# EAGLE schematic JanusV1 (EAGLE 7.3.0)
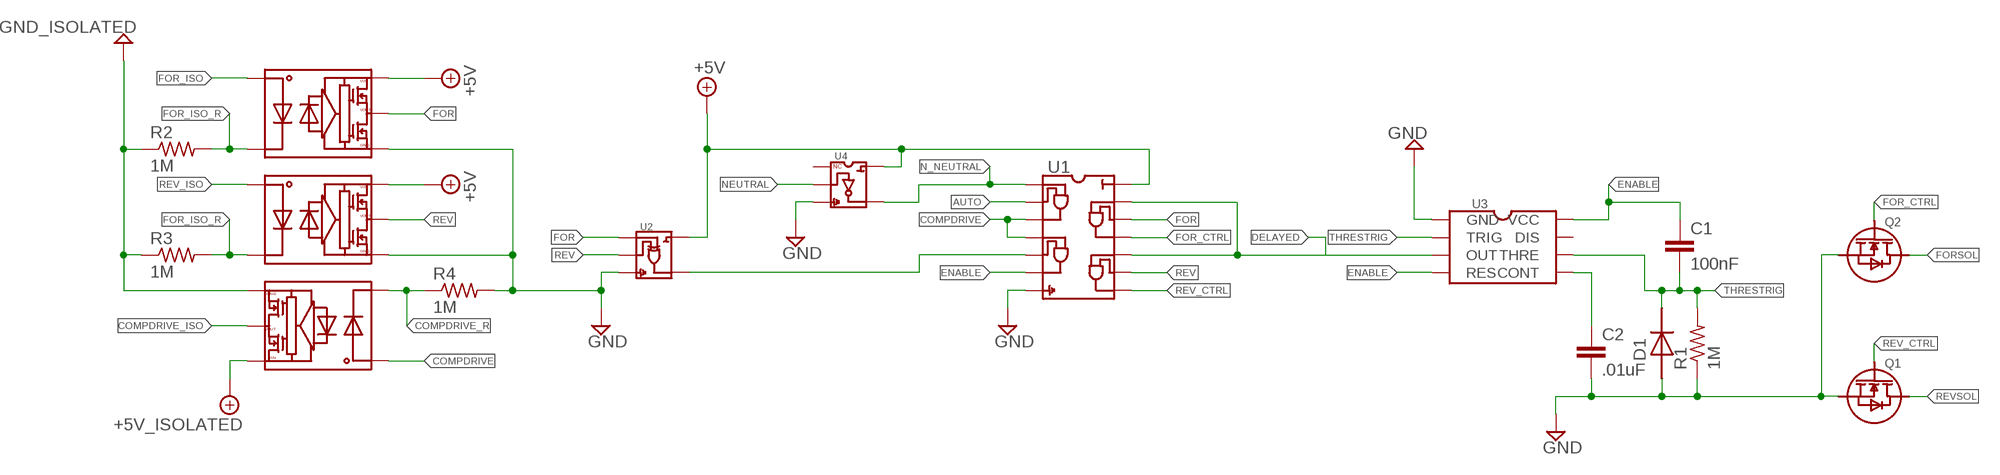
[diagram p0: schematic, sheet 1]

## Parts
C1  100nF  C-EUC0603  [C0603]
C2  .01uF  C-EUC0603  [C0603]
D1  1N4148X-TP  [SOD523_SC79]
OK1  TLP152  [6-SOIC-5]
OK2  TLP152  [6-SOIC-5]
OK3  TLP152  [6-SOIC-5]
Q1  DMN6140L-7  [SOT23]
Q2  DMN6140L-7  [SOT23]
R1  1M  R-US_R0603  [R0603]
R2  1M  R-US_R0603  [R0603]
R3  1M  R-US_R0603  [R0603]
R4  1M  R-US_R0603  [R0603]
U1  SN74LV08APWR  [TSSOP-14]
U2  74LVC1G86W5-7  [SOT-25]
U3  NE555S-13DICT-ND  [SO-8]
U4  74HCT1G14GW,125  [SOT-353]

## Nets
+5V: OK1.P$6 OK2.P$6 OK3.P$6 U1.P$14 U2.P$5 U4.P$5 ; supply symbol labelled +5V_ISOLATED
AUTO: U1.P$2
COMPDRIVE: OK3.P$1 U1.P$3 U1.P$4
COMPDRIVE_ISO: OK3.P$5
COMPDRIVE_R: OK3.P$3 R4.1
DELAYED: U1.P$10 U1.P$13 U3.P$3(OUT)
ENABLE: C1.1 U1.P$6 U3.P$4(RES) U3.P$8(VCC)
FOR: OK1.P$5 U1.P$12 U2.P$1
FOR_CTRL: Q2.P$1(G) U1.P$11
FOR_ISO: OK1.P$1
FOR_ISO_R: OK1.P$3 OK2.P$3 R2.2 R3.2
FORSOL: Q2.P$3(D)
GND: C2.2 D1.P$1 OK1.P$4 OK2.P$4 OK3.P$4 Q1.P$2(S) Q2.P$2(S) R1.1 R2.1 R3.1 R4.2 U1.P$7 U2.P$3 U3.P$1(GND) U4.P$3 ; supply symbol labelled GND_ISOLATED
N$5: U1.P$5 U2.P$4
N$6: C2.1 U3.P$5(CONT)
N_NEUTRAL: U1.P$1 U4.P$4
NEUTRAL: U4.P$2
REV: OK2.P$5 U1.P$9 U2.P$2
REV_CTRL: Q1.P$1(G) U1.P$8
REV_ISO: OK2.P$1
REVSOL: Q1.P$3(D)
THRESTRIG: C1.2 D1.P$2 R1.2 U3.P$2(TRIG) U3.P$6(THRE)
Unconnected: U3.P$7(DIS) U4.P$1

## Library data of the parts
C1 C2 = resistor:C-EU: CAPACITOR, European symbol
D1 = CP-Discrete:1N4148X-TP
OK1-OK3 = CP-Discrete:TLP152
Q1 Q2 = CP-Discrete:DMN6140L-7
R1-R4 = resistor:R-US_: RESISTOR, American symbol
U1 = CP-IC:SN74LV08APWR: Quad Two Input AND
U2 = CP-IC:74LVC1G86W5-7: Single Two Input XOR
U3 = CP-IC:NE555S-13DICT-ND: 555 Timer
U4 = CP-IC:74HCT1G14GW,125: Single One Input NOT